# Altium project Industrial-Controller.PrjPcb (part 1 of 3)
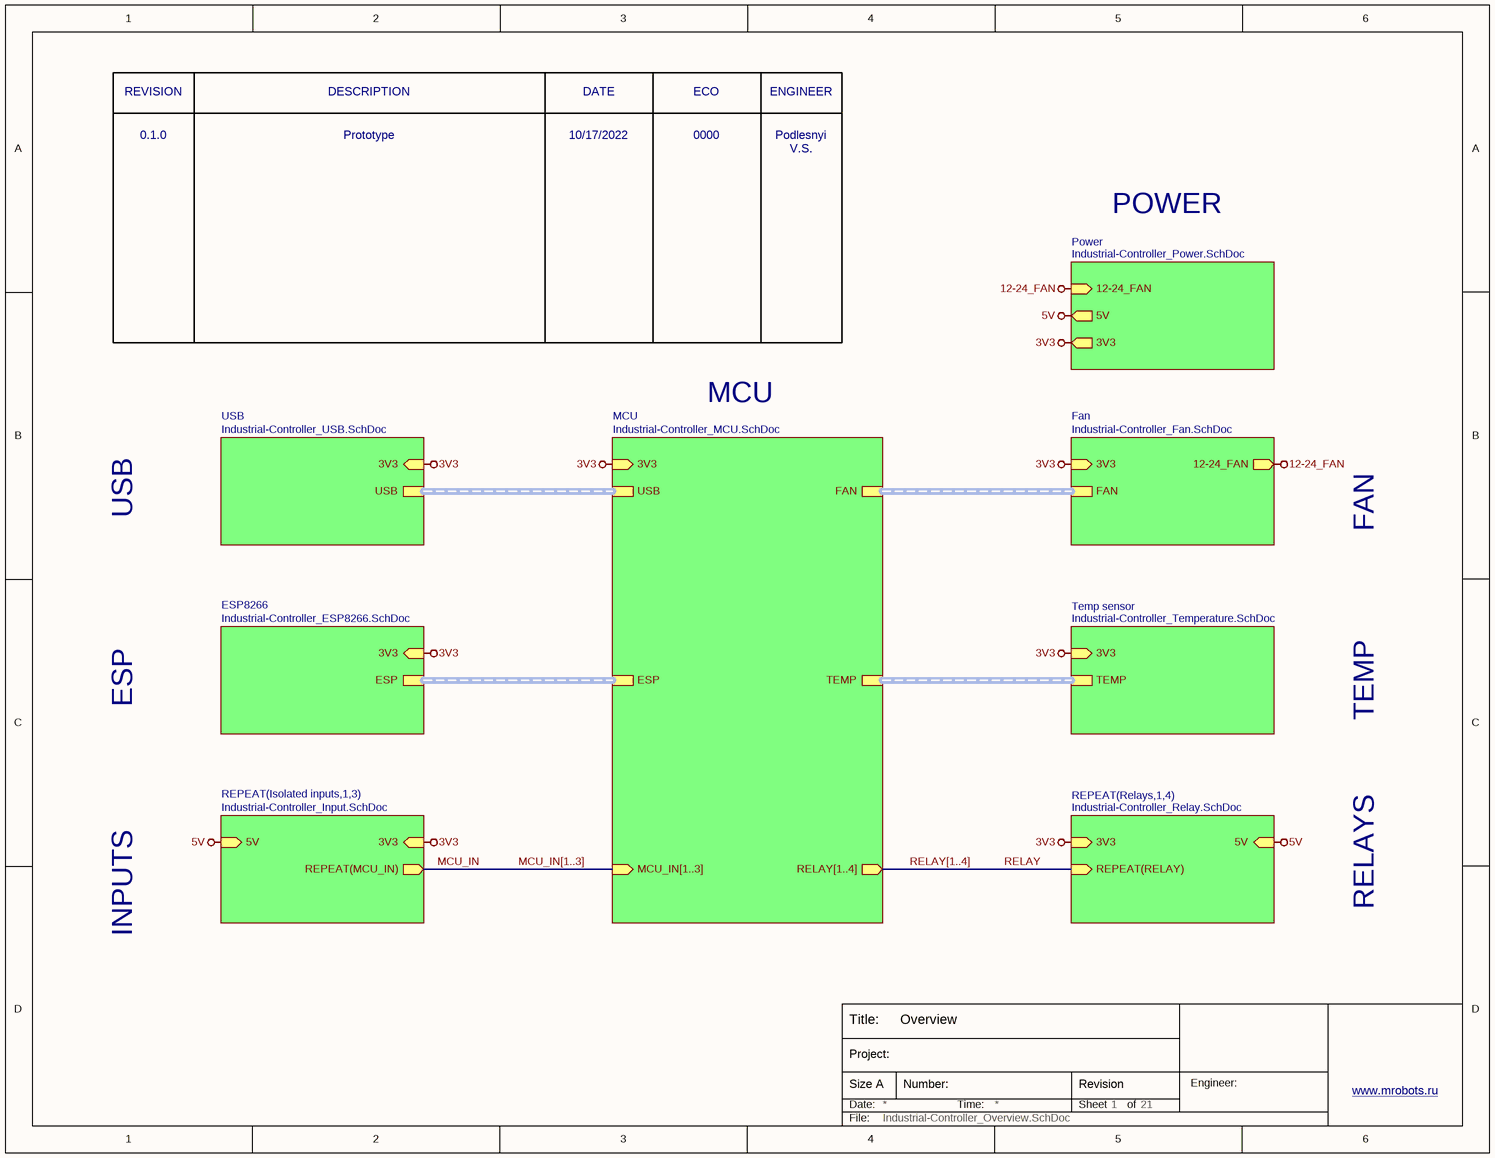
[diagram p0: Industrial-Controller_Overview.SchDoc]
GlobalAddress1: nab. reki Karpovki, d. 5/3E; GlobalAddress2: Saint-Petersburg, 197022; GlobalAddress3: Ph: +7 (911) 701-51-99; GlobalCompanyName: MRobot, LCC; GlobalDocumentNumberDrawingASM: 0000-0000; GlobalDocumentNumberDrawingPCB: 0000-0000; GlobalDocumentNumberPCB: 0000-0000; GlobalDocumentNumberSCH: 0000-0000; GlobalDocumentSubtitle: PLC; GlobalDocumentTitle: Industrial Controller; GlobalEngineer: Podlesnyi Vasilii; GlobalJiraKey: PLCMROBOT; GlobalProjectTitle: Industrial Controller; GlobalRevisionBOM: 0.1.0; GlobalRevisionPCB: 0.1.0; GlobalRevisionSCH: 0.1.0
9 sheets, 133 parts. Net scope: hierarchical (ports join the sheet entries above them; power ports are global).
Board file: Industrial-Controller.PcbDoc
Sheets:
  Industrial-Controller_Overview.SchDoc
    MCU = Industrial-Controller_MCU.SchDoc
    Temp sensor = Industrial-Controller_Temperature.SchDoc
    USB = Industrial-Controller_USB.SchDoc
    ESP8266 = Industrial-Controller_ESP8266.SchDoc
    Isolated inputs1 = Industrial-Controller_Input.SchDoc
    Isolated inputs2 = Industrial-Controller_Input.SchDoc
    Isolated inputs3 = Industrial-Controller_Input.SchDoc
    Relays1 = Industrial-Controller_Relay.SchDoc
    Relays2 = Industrial-Controller_Relay.SchDoc
    Relays3 = Industrial-Controller_Relay.SchDoc
    Relays4 = Industrial-Controller_Relay.SchDoc
    Fan = Industrial-Controller_Fan.SchDoc
    Power = Industrial-Controller_Power.SchDoc

## Sheet Industrial-Controller_Overview.SchDoc: Overview
size 279 x 215 mm; Date: not used; ApprovedBy: not used; CheckedBy: not used; Author: not used; CompanyName: MRobot, LCC; DrawnBy: not used; Engineer: Podlesnyi Vasilii; Organization: not used; Address1: nab. reki Karpovki, d. 5/3E; Address2: Saint-Petersburg, 197022; Address3: Ph: +7 (911) 701-51-99; Address4: not used; DocumentNumber: 0000-0000; Revision: 0.1.0; SheetNumber: 1; SheetTotal: 21; ProjectTitle: Industrial Controller; Time: not used; ImagePath: not used; Application_BuildNumber: not used

### Sub-sheets
ESP8266 = Industrial-Controller_ESP8266.SchDoc: 3V3 (in), ESP (harness ESP)
Fan = Industrial-Controller_Fan.SchDoc: FAN (harness FAN), 3V3 (in), 12-24_FAN (out)
MCU = Industrial-Controller_MCU.SchDoc: 3V3 (in), ESP (harness ESP), TEMP (harness TEMP), USB (harness USB), FAN (harness FAN), MCU_IN[1..3] (in), RELAY[1..4] (out)
Power = Industrial-Controller_Power.SchDoc: 3V3 (out), 12-24_FAN (in), 5V (out)
REPEAT(Isolated inputs,1,3) = Industrial-Controller_Input.SchDoc: 3V3 (in), 5V (in), REPEAT(MCU_IN) (out)
REPEAT(Relays,1,4) = Industrial-Controller_Relay.SchDoc: 3V3 (in), REPEAT(RELAY) (in), 5V (in)
Temp sensor = Industrial-Controller_Temperature.SchDoc: TEMP (harness TEMP), 3V3 (in)
USB = Industrial-Controller_USB.SchDoc: 3V3 (in), USB (harness USB)

### Nets
3V3: sheet MCU/3V3, sheet Temp sensor/3V3, sheet USB/3V3, sheet ESP8266/3V3, sheet REPEAT(Isolated inputs,1,3)/3V3, sheet REPEAT(Relays,1,4)/3V3, sheet Fan/3V3, sheet Power/3V3
5V: sheet REPEAT(Isolated inputs,1,3)/5V, sheet REPEAT(Relays,1,4)/5V, sheet Power/5V
12-24_FAN: sheet Fan/12-24_FAN, sheet Power/12-24_FAN
MCU_IN: sheet REPEAT(Isolated inputs,1,3)/REPEAT(MCU_IN)
RELAY: sheet REPEAT(Relays,1,4)/REPEAT(RELAY)

### Buses and harness runs
bus MCU_IN[1..3] = sheet MCU/MCU_IN[1..3]
bus RELAY[1..4] = sheet MCU/RELAY[1..4]
harness sheet ESP8266/ESP = sheet MCU/ESP
harness sheet Fan/FAN = sheet MCU/FAN
harness sheet MCU/TEMP = sheet Temp sensor/TEMP
harness sheet MCU/USB = sheet USB/USB

### Notes on the sheet
- REVISION
- DESCRIPTION
- DATE
- ECO
- ENGINEER
- POWER
- 0.1.0
- Prototype
- 10/17/2022
- 0000
- Podlesnyi V.S.
- MCU
- USB
- FAN
- ESP
- TEMP
- RELAYS
- INPUTS
- Title:
- Date:
- Size A
- Project:
- Number:
- Time:
- Sheet
- Revision
- of
- Engineer:
- www.mrobots.ru <http://mrobots.ru/>
- File:

## Sheet Industrial-Controller_MCU.SchDoc: MCU
size 279 x 215 mm; Date: not used; ApprovedBy: not used; CheckedBy: not used; Author: not used; CompanyName: MRobot, LCC; DrawnBy: not used; Engineer: Podlesnyi Vasilii; Organization: not used; Address1: nab. reki Karpovki, d. 5/3E; Address2: Saint-Petersburg, 197022; Address3: Ph: +7 (911) 701-51-99; Address4: not used; DocumentNumber: 0000-0000; Revision: 0.1.0; SheetNumber: 3; SheetTotal: 21; ProjectTitle: Industrial Controller; Time: not used; ImagePath: not used; Application_BuildNumber: not used
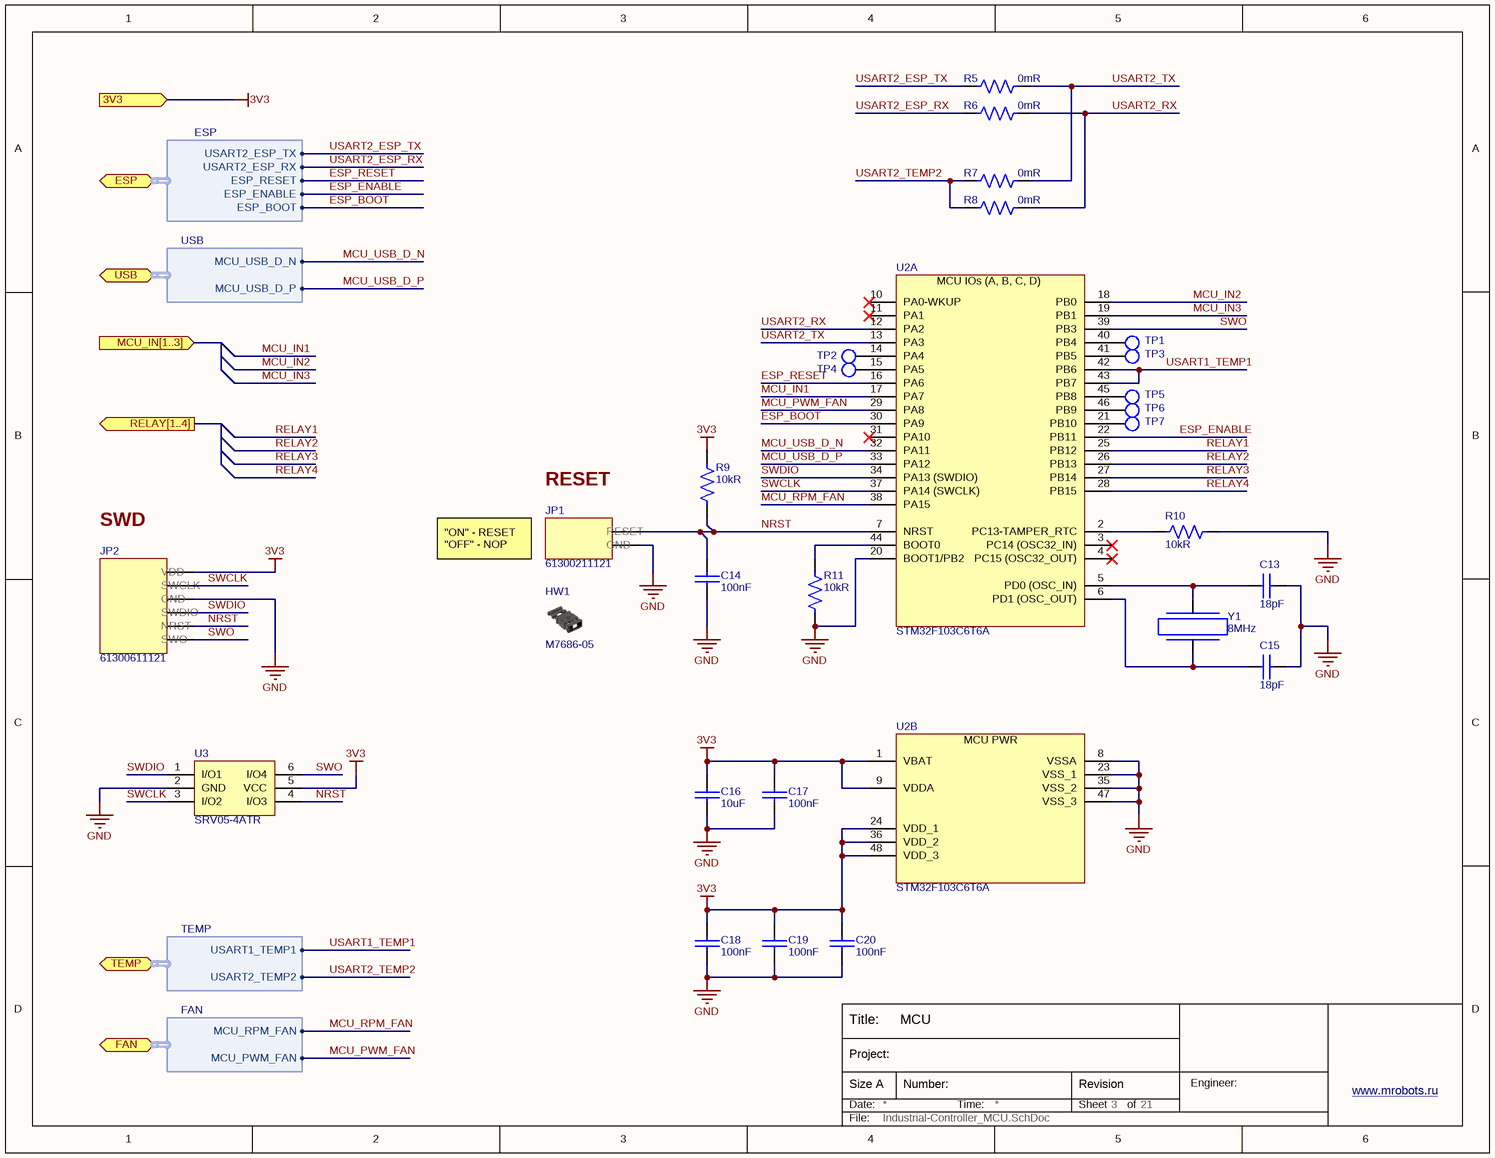
[diagram p1: Industrial-Controller_MCU.SchDoc]

### Parts
C13  18pF  [CAP_0603]
C14  100nF  [CAP_0603]
C15  18pF  [CAP_0603]
C16  10uF  [CAP_1210]
C17  100nF  [CAP_0603]
C18  100nF  [CAP_0603]
C19  100nF  [CAP_0603]
C20  100nF  [CAP_0603]
HW1  M7686-05  (mechanical)
JP1  61300211121  [PLS-2]
JP2  61300611121  [PLS-6]
R5  0mR  [RES_0603]
R6  0mR  [RES_0603]
R7  0mR  [RES_0603]
R8  0mR  [RES_0603]
R9  10kR  [RES_0603]
R10  10kR  [RES_0603]
R11  10kR  [RES_0603]
TP1  TEST_POINT_SMT  [TEST_POINT_SMT]  (value not drawn)  (no BOM)
TP2  TEST_POINT_SMT  [TEST_POINT_SMT]  (value not drawn)  (no BOM)
TP3  TEST_POINT_SMT  [TEST_POINT_SMT]  (value not drawn)  (no BOM)
TP4  TEST_POINT_SMT  [TEST_POINT_SMT]  (value not drawn)  (no BOM)
TP5  TEST_POINT_SMT  [TEST_POINT_SMT]  (value not drawn)  (no BOM)
TP6  TEST_POINT_SMT  [TEST_POINT_SMT]  (value not drawn)  (no BOM)
TP7  TEST_POINT_SMT  [TEST_POINT_SMT]  (value not drawn)  (no BOM)
U2  STM32F103C6T6A  [LQFP48]  (parts A,B of 2)
U3  SRV05-4ATR  [SOT-23-6]
Y1  8MHz  [HC-49/US]

### Ports
3V3 (in), ESP (bidir, harness ESP), FAN (bidir, harness FAN), MCU_IN[1..3] (in), RELAY[1..4] (out), TEMP (bidir, harness TEMP), USB (bidir, harness USB)

### Harnesses
ESP: USART2_ESP_TX, USART2_ESP_RX, ESP_RESET, ESP_ENABLE, ESP_BOOT
USB: MCU_USB_D_N, MCU_USB_D_P
FAN: MCU_RPM_FAN, MCU_PWM_FAN
TEMP: USART1_TEMP1, USART2_TEMP2

### Nets
3V3: C16.2 C17.1 C18.1 C19.1 C20.1 JP2.1 R9.1 U2.1(VBAT) U2.9(VDDA) U2.24(VDD_1) U2.36(VDD_2) U2.48(VDD_3) U3.5(VCC) ; port 3V3
GND: C13.2 C14.2 C15.2 C16.1 C17.2 C18.2 C19.2 C20.2 JP1.2 JP2.3 R10.1 R11.1 U2.8(VSSA) U2.20(BOOT1/PB2) U2.23(VSS_1) U2.35(VSS_2) U2.47(VSS_3) U3.2(GND)
ESP_BOOT: U2.30(PA9) ; port ESP.ESP_BOOT
ESP_ENABLE: U2.22(PB11) ; port ESP.ESP_ENABLE
ESP_RESET: U2.16(PA6) ; port ESP.ESP_RESET
MCU_IN1: U2.17(PA7)
MCU_IN2: U2.18(PB0)
MCU_IN3: U2.19(PB1)
MCU_PWM_FAN: U2.29(PA8) ; port FAN.MCU_PWM_FAN
MCU_RPM_FAN: U2.38(PA15) ; port FAN.MCU_RPM_FAN
MCU_USB_D_N: U2.32(PA11) ; port USB.MCU_USB_D_N
MCU_USB_D_P: U2.33(PA12) ; port USB.MCU_USB_D_P
NRST: C14.1 JP1.1 JP2.5 R9.2 U2.7(NRST) U3.4(I/O3)
RELAY1: U2.25(PB12)
RELAY2: U2.26(PB13)
RELAY3: U2.27(PB14)
RELAY4: U2.28(PB15)
SWCLK: JP2.2 U2.37(PA14_(SWCLK)) U3.3(I/O2)
SWDIO: JP2.4 U2.34(PA13_(SWDIO)) U3.1(I/O1)
SWO: JP2.6 U2.39(PB3) U3.6(I/O4)
USART1_TEMP1: U2.42(PB6) U2.43(PB7) ; port TEMP.USART1_TEMP1
USART2_ESP_RX: R6.1 ; port ESP.USART2_ESP_RX
USART2_ESP_TX: R5.1 ; port ESP.USART2_ESP_TX
USART2_RX: R6.2 R8.2 U2.12(PA2)
USART2_TEMP2: R7.1 R8.1 ; port TEMP.USART2_TEMP2
USART2_TX: R5.2 R7.2 U2.13(PA3)
NetC13_1: C13.1 U2.5(PD0_(OSC_IN)) Y1.2
NetC15_1: C15.1 U2.6(PD1_(OSC_OUT)) Y1.1
NetR10_2: R10.2 U2.2(PC13-TAMPER_RTC)
NetR11_2: R11.2 U2.44(BOOT0)
NetTP1_1: TP1.1 U2.40(PB4)
NetTP2_1: TP2.1 U2.14(PA4)
NetTP3_1: TP3.1 U2.41(PB5)
NetTP4_1: TP4.1 U2.15(PA5)
NetTP5_1: TP5.1 U2.45(PB8)
NetTP6_1: TP6.1 U2.46(PB9)
NetTP7_1: TP7.1 U2.21(PB10)

Not connected (* = marked no-connect by the designer): U2 3(PC14_(OSC32_IN))* 4(PC15_(OSC32_OUT))* 10(PA0-WKUP)* 11(PA1)* 31(PA10)*

### Notes on the sheet
- (near JP1) RESET
- SWD
- (near HW1) "ON" - RESET
  "OFF" - NOP
- Title:
- Date:
- Size A
- Project:
- Number:
- Time:
- Sheet
- Revision
- of
- Engineer:
- www.mrobots.ru <http://mrobots.ru/>
- File:
- (in symbol STM32F103C6T6A, part A) MCU IOs (A, B, C, D)
- (in symbol STM32F103C6T6A, part B) MCU PWR

### Library data of the parts
C13 C15 = C0603C180J5GACAUTO: CAP CER 18PF 50V C0G/NP0 0603; Manufacturer: KEMET; Dielectric Material: Ceramic; Tolerance: 5%; Dielectric: C0G; Supplier 1: Arrow Electronics; Manufacturer Part Number: C0603C180J5GACAUTO; RoHS: Yes; Category: Ceramic Capacitors; Stock 1: 13801; Pricing 1: 1=0.10780, 10=0.04490, 25=0.04440, 100=0.03270, 250=0.03140, 500=0.02510, 1000=0.01950, 3000=0.01910, 6000=0.01510 (USD); Case/Package: 0603; Min Operating Temperature: -55°C; Max Operating Temperature: 125°C; Packaging: Tape and Reel; Capacitance: 18pF; Voltage Rating (DC): 50V; Length: 1.6mm; Depth: 0.8mm; Lead Free: Lead Free; RoHS Compliant: Yes; ComponentLink1URL: http://www.farnell.com/datasheets/2747367.pdf?src-supplier=Farnell; ComponentLink1Description: http://www.farnell.com/datasheets/2747367.pdf?src-supplier=Farnell; ComponentLink2URL: https://api.kemet.com/component-edge/download/datasheet/C0603C180J5GACAUTO.pdf?src-supplier=Digi-Key; ComponentLink2Description: https://api.kemet.com/component-edge/download/datasheet/C0603C180J5GACAUTO.pdf?src-supplier=Digi-Key; ComponentLink3URL: http://www.farnell.com/datasheets/2747367.pdf?src-supplier=Newark; ComponentLink3Description: http://www.farnell.com/datasheets/2747367.pdf?src-supplier=Newark; ComponentLink4URL: http://www.farnell.com/datasheets/2747367.pdf?src-supplier=Element14; ComponentLink4Description: http://www.farnell.com/datasheets/2747367.pdf?src-supplier=Element14; Supplier Part Number 1: C0603C180J5GACAUTO; Manufacturer 1: KEMET; Manufacturer Part Number 1: C0603C180J5GACAUTO
C14 C17-C20 = CL10B104KB8NNNL: CAP CER 0.1UF 50V X7R 0603; Manufacturer 1: Samsung; Tolerance: 10%; Supplier 1: Digi-Key; Manufacturer Part Number 1: CL10B104KB8NNNL; RoHS: Yes; Category: Ceramic Capacitors; Stock 1: 2348404; Pricing 1: 15000=0,00532, 30000=0,00506 (USD); Mount: Surface Mount; Case/Package: 0603; Min Operating Temperature: -55°C; Max Operating Temperature: 125°C; Capacitance: 100nF; Packaging: Tape and Reel; Package Quantity: 15000; Voltage Rating: 50V; Dielectric: X7R; Voltage Rating (DC): 50V; Series: CL; Construction: Flat; Length: 1.6mm; Width: 0.031inch; Height: 0.8mm; Thickness: 0.035inch; Depth: 0.8mm; Radiation Hardening: No; RoHS Compliant: Yes; ComponentLink1URL: https://datasheet.ciiva.com/26838/getdatasheetpartid-357523-26838415.pdf?src-supplier=Verical; ComponentLink1Description: https://datasheet.ciiva.com/26838/getdatasheetpartid-357523-26838415.pdf?src-supplier=Verical; ComponentLink2URL: https://datasheet.ciiva.com/25741/cl10b104kb8nnnl-25741341.pdf?src-supplier=Digi-Key; ComponentLink2Description: https://datasheet.ciiva.com/25741/cl10b104kb8nnnl-25741341.pdf?src-supplier=Digi-Key; Supplier Part Number 1: 1276-CL10B104KB8NNNLTR-ND
C16 = CL32B106KBJNNWE: CAP CER 10UF 50V X7R 1210; Manufacturer 1: Samsung; Tolerance: 10%; Supplier 1: Digi-Key; Manufacturer Part Number 1: CL32B106KBJNNWE; RoHS: Yes; Category: Ceramic Capacitors; Stock 1: 395336; Pricing 1: 1=0,64000, 10=0,45500, 50=0,34380, 100=0,29940, 500=0,22176 (USD); Mount: Surface Mount; Case/Package: 1210; Case Code (Imperial): 1210; Case Code (Metric): 3225; Min Operating Temperature: -55°C; Max Operating Temperature: 125°C; Dielectric: X7R; Capacitance: 10uF; Voltage Rating: 50V; Package Quantity: 1; Packaging: Tape and Reel; Length: 0.126inch; Width: 0.098inch; Thickness: 0.106inch; Lead Free: Lead Free; ComponentLink1URL: https://datasheet.ciiva.com/25721/cl32b106kbjnnwe-25721651.pdf?src-supplier=Digi-Key; ComponentLink1Description: https://datasheet.ciiva.com/25721/cl32b106kbjnnwe-25721651.pdf?src-supplier=Digi-Key; Supplier Part Number 1: 1276-3388-1-ND
HW1 = M7686-05: CLOSED TOP JUMPER SOCKET; Manufacturer 1: Harwin; Plating: Gold; Number of Contacts: 2; Contact Resistance: 25mR; Current Rating: 3A; Mating Cycles: 300; Voltage Rating (AC): 250V; Gender: Receptacle; Insulation Resistance: 1GR; Pitch: 2.54mm; Body Length: 10mm; Supplier 1: Digi-Key; Manufacturer Part Number 1: M7686-05; RoHS: Yes; Category: Terminal Blocks; Stock 1: 26597; Pricing 1: 1=0,40000, 10=0,34400, 25=0,30280, 50=0,27820, 100=0,26720, 250=0,23996, 500=0,22906, 1000=0,19089, 2500=0,17453 (USD); Housing Color: Black; Contact Material: Bronze; Contact Plating: Gold; Color: Black; Material: Polyester; Weight: 0.0625lb; Housing Material: Polyester; Min Operating Temperature: -40°C; Max Operating Temperature: 85°C; Number of Rows: 1; Voltage Rating (DC): 250V; Contact Gender: Female; Package Quantity: 2500; Voltage Rating: 250V; Max Current Rating: 3A; Number of Positions: 2; Packaging: Bulk; Max Voltage Rating (AC): 250V; Orientation: Straight; Series: M76; Length: 10mm; Width: 5mm; Height: 0.394inch; Lead Pitch: 2.54mm; Depth: 2.4mm; Radiation Hardening: No; REACH SVHC: No SVHC; Flammability Rating: UL94 V-0; RoHS Compliant: Yes; ComponentLink1URL: https://datasheet.ciiva.com/11754/0900766b81034e4c-11754957.pdf?src-supplier=RSComponents; ComponentLink1Description: https://datasheet.ciiva.com/11754/0900766b81034e4c-11754957.pdf?src-supplier=RSComponents; ComponentLink2URL: https://datasheet.ciiva.com/6781/m7684-m7687-6781583.pdf?src-supplier=Digi-Key; ComponentLink2Description: https://datasheet.ciiva.com/6781/m7684-m7687-6781583.pdf?src-supplier=Digi-Key; Supplier Part Number 1: 952-2023-ND
JP1 = 61300211121: CONN HEADER VERT 2POS 2.54MM; Manufacturer 1: Wurth Electronics; Current Rating: 3A; Voltage Rating: 250V; Number of Positions: 2; Gender: Male; Connector Type: Male Pin; Pitch: 0.1inch; Contact_1: RESET; Contact_2: GND; Supplier 1: Digi-Key; RoHS: Yes; Category: Headers and Wire Housings; Pricing 1: 1=0.13000, 10=0.11000, 25=0.09120, 50=0.07700, 100=0.06900, 1000=0.06300 (USD); Mount: Through Hole; Contact Plating: Gold; Housing Material: PBT; Contact Material: Copper Alloy,Copper; Color: Black; Min Operating Temperature: -40°C; Max Operating Temperature: 125°C; Number of Rows: 1; Contact Gender: Male; Packaging: Bulk; Termination: Through Hole; Number of Contacts: 2; Series: WR-PHD; Contact Type: Male Pin; Contact Mating Length: 0.236inch; REACH SVHC: Unknown; Lead Free: Lead Free; RoHS Compliant: Yes; ComponentLink1URL: https://datasheet.ciiva.com/13619/6130xx11121-48870-13619345.pdf?src-supplier=Mouser; ComponentLink1Description: https://datasheet.ciiva.com/13619/6130xx11121-48870-13619345.pdf?src-supplier=Mouser; Supplier Part Number 1: 732-5315-ND; Manufacturer Part Number 1: 61300211121
JP2 = 61300611121: CONN HEADER VERT 6POS 2.54MM; Manufacturer 1: Wurth Electronics; Current Rating: 3A; Voltage Rating: 250V; Number of Positions: 6; Gender: Male; Connector Type: Male Pin; Pitch: 0.1inch; Contact_1: VDD; Contact_2: SWCLK; Contact_3: GND; Contact_4: SWDIO; Contact_5: NRST; Contact_6: SWO; Supplier 1: Digi-Key; RoHS: Yes; Category: Headers and Wire Housings; Stock 1: 8041; Pricing 1: 1=0.34000, 10=0.28900, 25=0.24000, 50=0.20100, 100=0.18200, 1000=0.16600 (USD); Mount: Through Hole; Contact Plating: Gold; Contact Material: Copper Alloy,Copper; Housing Material: PBT; Color: Black; Min Operating Temperature: -40°C; Max Operating Temperature: 125°C; Number of Rows: 1; Contact Gender: Male; Packaging: Bulk; Termination: Through Hole; Number of Contacts: 6; Series: WR-PHD; Contact Type: Male Pin; Contact Mating Length: 0.236inch; REACH SVHC: Unknown; Lead Free: Lead Free; RoHS Compliant: Yes; ComponentLink1URL: http://www.mouser.com/ds/2/445/6130xx11121-538006.pdf?src-supplier=Mouser; ComponentLink1Description: http://www.mouser.com/ds/2/445/6130xx11121-538006.pdf?src-supplier=Mouser; ComponentLink2URL: http://www.farnell.com/cad/1737268.pdf?src-supplier=Element14; ComponentLink2Description: http://www.farnell.com/cad/1737268.pdf?src-supplier=Element14; ComponentLink3URL: https://katalog.we-online.de/em/datasheet/6130xx11121.pdf?src-supplier=Digi-Key; ComponentLink3Description: https://katalog.we-online.de/em/datasheet/6130xx11121.pdf?src-supplier=Digi-Key; Supplier Part Number 1: 732-5319-ND; Manufacturer Part Number 1: 61300611121
R5-R8 = RC0603FR-070RL: RES 0 OHM JUMPER 1/10W 0603; Manufacturer 1: Yageo; Power Rating: 100mW; Tolerance: 1%; Voltage Rating (DC): 50V; Temperature Coefficient: 200ppm/°C; Current Rating: 1A; Working Voltage: 75V; Supplier 1: Arrow Electronics; RoHS: Yes; Category: Chip SMD Resistors; Stock 1: 2434418; Pricing 1: 5000=0,00220 (USD); Case/Package: 0603; Number of Pins: 2; Contact Plating: Tin,Matte; Case Code (Metric): 1608; Case Code (Imperial): 0603; Min Operating Temperature: -55°C; Max Operating Temperature: 155°C; Resistance: 0mR; Packaging: Tape and Reel; Resistor Type: Thick Film; Package Quantity: 5000; Voltage Rating: 50V; Number of Terminations: 2; Termination: SMD/SMT; Max Power Dissipation: 100mW; Features: Moisture Resistant; Series: RC; Construction: Rectangular; Resistance Tolerance: 1%; Technology: THICK FILM; Length: 1.6mm; Width: 0.031inch; Height: 0.45mm; Depth: 0.8mm; Radiation Hardening: No; REACH SVHC: No SVHC; Lead Free: Lead Free; RoHS Compliant: Yes; Military Standard: Not; ComponentLink1URL: https://datasheet.ciiva.com/11808/0900766b80f96399-11808172.pdf?src-supplier=RSComponents; ComponentLink1Description: https://datasheet.ciiva.com/11808/0900766b80f96399-11808172.pdf?src-supplier=RSComponents; ComponentLink2URL: https://datasheet.ciiva.com/5684/443971-5684699.pdf?src-supplier=Farnell; ComponentLink2Description: https://datasheet.ciiva.com/5684/443971-5684699.pdf?src-supplier=Farnell; ComponentLink3URL: https://datasheet.ciiva.com/7983/443971-7983627.pdf?src-supplier=Element14; ComponentLink3Description: https://datasheet.ciiva.com/7983/443971-7983627.pdf?src-supplier=Element14; ComponentLink4URL: https://datasheet.ciiva.com/22643/1868787-22643388.pdf?src-supplier=Element14; ComponentLink4Description: https://datasheet.ciiva.com/22643/1868787-22643388.pdf?src-supplier=Element14; ComponentLink5URL: https://datasheet.ciiva.com/46382/443971-46382072.pdf?src-supplier=Element14; ComponentLink5Description: https://datasheet.ciiva.com/46382/443971-46382072.pdf?src-supplier=Element14; ComponentLink6URL: https://datasheet.ciiva.com/29721/pyu-r-int-thick-7-29721178.pdf?src-supplier=Digi-Key; ComponentLink6Description: https://datasheet.ciiva.com/29721/pyu-r-int-thick-7-29721178.pdf?src-supplier=Digi-Key; ComponentLink7URL: https://datasheet.ciiva.com/29721/pyu-rc0603-51-rohs-l-4-29721179.pdf?src-supplier=Digi-Key; ComponentLink7Description: https://datasheet.ciiva.com/29721/pyu-rc0603-51-rohs-l-4-29721179.pdf?src-supplier=Digi-Key; ComponentLink8URL: https://datasheet.ciiva.com/5558/rc0603-272842-5558341.pdf?src-supplier=Mouser; ComponentLink8Description: https://datasheet.ciiva.com/5558/rc0603-272842-5558341.pdf?src-supplier=Mouser; Supplier Part Number 1: RC0603FR-070RL; Manufacturer Part Number 1: RC0603FR-070RL
R9-R11 = RC0603FR-0710KL: RES 10K OHM 1% 1/10W 0603; Manufacturer 1: Yageo; Voltage Rating (DC): 50V; Temperature Coefficient: 100ppm/°C; Power Rating: 100mW; Voltage Rating: 75V; Supplier 1: Arrow Electronics; RoHS: Yes; Category: Chip SMD Resistors; Stock 1: 4950000; Pricing 1: 5000=0,00240 (USD); Case/Package: 0603; Number of Pins: 2; Case Code (Imperial): 0603; Case Code (Metric): 1608; Weight: 7.1E-05oz; Size Code: 0603; Min Operating Temperature: -55°C; Max Operating Temperature: 155°C; Packaging: Tape and Reel; Resistance: 10kR; Tolerance: 1%; Resistor Type: Thick Film; Termination: SMD/SMT; Features: Moisture Resistant; Series: RC; Max Power Dissipation: 100mW; Number of Terminations: 2; Resistance Tolerance: 1%; Construction: Rectangular; Length: 1.6mm; Width: 0.8mm; Height: 0.45mm; Depth: 0.8mm; Lead Pitch: 0.3mm; REACH SVHC: Unknown; Lead Free: Lead Free; Military Standard: Not; RoHS Compliant: Yes; ComponentLink1URL: https://datasheet.ciiva.com/7660/38590-7660789.pdf?src-supplier=Element14; ComponentLink1Description: https://datasheet.ciiva.com/7660/38590-7660789.pdf?src-supplier=Element14; ComponentLink2URL: https://datasheet.ciiva.com/7983/443971-7983596.pdf?src-supplier=Element14; ComponentLink2Description: https://datasheet.ciiva.com/7983/443971-7983596.pdf?src-supplier=Element14; ComponentLink3URL: https://datasheet.ciiva.com/22747/443971-22747519.pdf?src-supplier=Element14; ComponentLink3Description: https://datasheet.ciiva.com/22747/443971-22747519.pdf?src-supplier=Element14; ComponentLink4URL: https://datasheet.ciiva.com/46440/1868787-46440891.pdf?src-supplier=Element14; ComponentLink4Description: https://datasheet.ciiva.com/46440/1868787-46440891.pdf?src-supplier=Element14; ComponentLink5URL: https://datasheet.ciiva.com/7746/1738695-7746239.pdf?src-supplier=Element14; ComponentLink5Description: https://datasheet.ciiva.com/7746/1738695-7746239.pdf?src-supplier=Element14; Supplier Part Number 1: RC0603FR-0710KL; Manufacturer Part Number 1: RC0603FR-0710KL
TP1-TP7 = TEST_POINT_SMT: STM TEST POINT
U2 = STM32F103C6T6A: IC MCU 32BIT 32KB FLASH 48LQFP; Manufacturer 1: STMicroelectronics; Number of Timers/Counters: 3; Max Supply Voltage: 3.6V; Frequency: 72MHz; Interface: I2C,SPI,USART; RAM Size: 10KB; Max Power Dissipation: 363mW; Number of I/Os: 37; Min Supply Voltage: 2V; Oscillator Type: Internal; Data Bus Width: 32b; Watchdog Timer: Yes; Peripherals: POR,PWM,WDT,DMA,Temp Sensor,I2C; Core Architecture: ARM; Number of ADC Channels: 10; Number of SPI Channels: 1; Supplier 1: Newark; RoHS: Yes; Category: Microcontrollers; Pricing 1: 1=6,56000, 10=5,90000, 1500=5,90000 (USD); Case/Package: LQFP; Number of Pins: 48; Weight: 0.006409oz; Min Operating Temperature: -40°C; Max Operating Temperature: 85°C; Package Quantity: 1500; Packaging: Tray; Max Frequency: 72MHz; Number of Programmable I/O: 37; Memory Type: FLASH; Memory Size: 32KB; Series: STM32F103C6; Number of I2C Channels: 1; Address Bus Width: 32b; Length: 7mm; Width: 7mm; Height: 1.4mm; Radiation Hardening: No; Lead Free: Lead Free; REACH SVHC: No SVHC; RoHS Compliant: Yes; ComponentLink1URL: https://datasheet.ciiva.com/15122/getdatasheetpartid-69879-15122075.pdf?src-supplier=Verical; ComponentLink1Description: https://datasheet.ciiva.com/15122/getdatasheetpartid-69879-15122075.pdf?src-supplier=Verical; ComponentLink2URL: https://datasheet.ciiva.com/14100/pustm-arm-microcont-stm32f103-en-14100507.pdf?src-supplier=Distrelec; ComponentLink2Description: https://datasheet.ciiva.com/14100/pustm-arm-microcont-stm32f103-en-14100507.pdf?src-supplier=Distrelec; Supplier Part Number 1: 57P1219; Manufacturer Part Number 1: STM32F103C6T6A
U3 = SRV05-4ATR: TVS DIODE 5VWM 17.5VC SOT23-6; Manufacturer 1: Sangdest Microelectronics; Supplier 1: Digi-Key; Manufacturer Part Number 1: SRV05-4ATR; RoHS: No; Category: TVS Diodes; Stock 1: 31500; Pricing 1: 1=0,45000, 10=0,36700, 100=0,24990, 500=0,18744, 1000=0,14058 (USD); Supplier Part Number 1: 1655-1653-1-ND
Y1 = ATS080B-E: CRYSTAL 8.0000MHZ 18PF TH; Manufacturer 1: CTS; Frequency Tolerance: 30ppm; ESR (Equivalent Series Resistance): 60R; Frequency Stability: 50ppm; Supplier 1: Avnet; RoHS: Yes; Category: Crystals; Stock 1: 4510; Pricing 1: 1000=0.18120, 1200=0.17880, 2200=0.17040, 5000=0.13800, 10000=0.12150, 50000=0.10956, 100000=0.10707 (USD); Mount: Through Hole; Number of Pins: 2; Contact Plating: Copper,Tin,Silver; Min Operating Temperature: -40°C; Max Operating Temperature: 85°C; Package Quantity: 100; Frequency: 8MHz; Load Capacitance: 18pF; Packaging: Bulk; Tolerance: 30ppm; Termination: Radial; Series: ATS; Length: 0.427inch; Width: 0.177inch; Height: 0.145inch; RoHS Compliant: Yes; ComponentLink1URL: https://datasheet.ciiva.com/859/008-0309-0-859649.pdf?src-supplier=Digi-Key; ComponentLink1Description: https://datasheet.ciiva.com/859/008-0309-0-859649.pdf?src-supplier=Digi-Key; ComponentLink2URL: https://datasheet.ciiva.com/3176/008-0309-0-3176342.pdf?src-supplier=Avnet; ComponentLink2Description: https://datasheet.ciiva.com/3176/008-0309-0-3176342.pdf?src-supplier=Avnet; ComponentLink3URL: https://datasheet.ciiva.com/4945/008-0309-0-32667-4945355.pdf?src-supplier=Mouser; ComponentLink3Description: https://datasheet.ciiva.com/4945/008-0309-0-32667-4945355.pdf?src-supplier=Mouser; Supplier Part Number 1: ATS080B-E; Manufacturer Part Number 1: ATS080B-E

## Sheet Industrial-Controller_Temperature.SchDoc: Temp sensor
size 279 x 215 mm; Date: not used; ApprovedBy: not used; CheckedBy: not used; Author: not used; CompanyName: MRobot, LCC; DrawnBy: not used; Engineer: Podlesnyi Vasilii; Organization: not used; Address1: nab. reki Karpovki, d. 5/3E; Address2: Saint-Petersburg, 197022; Address3: Ph: +7 (911) 701-51-99; Address4: not used; DocumentNumber: 0000-0000; Revision: 0.1.0; SheetNumber: 7; SheetTotal: 21; ProjectTitle: Industrial Controller; Time: not used; ImagePath: not used; Application_BuildNumber: not used
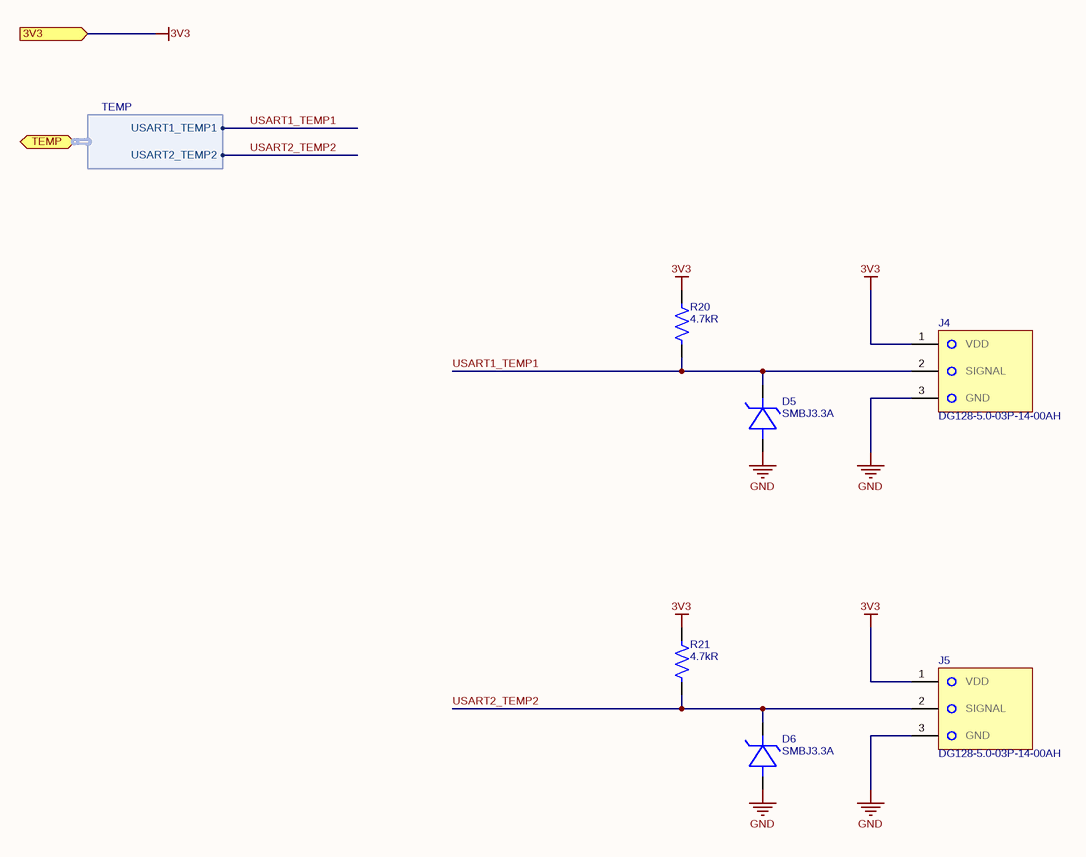
[diagram p2: Industrial-Controller_Temperature.SchDoc]

### Parts
D5  SMBJ3.3A  [SMB]
D6  SMBJ3.3A  [SMB]
J4  DG128-5.0-03P-14-00AH  [DG128-5.0-03P-14]
J5  DG128-5.0-03P-14-00AH  [DG128-5.0-03P-14]
R20  4.7kR  [RES_0603]
R21  4.7kR  [RES_0603]

### Ports
3V3 (in), TEMP (bidir, harness TEMP)

### Harnesses
TEMP: USART1_TEMP1, USART2_TEMP2

### Nets
3V3: J4.1 J5.1 R20.1 R21.1 ; port 3V3
GND: D5.2(A) D6.2(A) J4.3 J5.3
USART1_TEMP1: D5.1(C) J4.2 R20.2 ; port TEMP.USART1_TEMP1
USART2_TEMP2: D6.1(C) J5.2 R21.2 ; port TEMP.USART2_TEMP2

### Notes on the sheet
- Title:
- Date:
- Size A
- Project:
- Number:
- Time:
- Sheet
- Revision
- of
- Engineer:
- www.mrobots.ru <http://mrobots.ru/>
- File:

### Library data of the parts
D5 D6 = SMBJ3.3A: TVS DIODE 3.3VWM 4.1VC SMB; Manufacturer 1: JGD Semiconductors Co.,Ltd; Manufacturer Part Number 1: SMBJ3.3A
J4 J5 = DG128-5.0-03P-14: TERM BLK 3P TOP ENTRY 5MM SMD; Manufacturer 1: Degson; Number of Contacts: 3; Stripping Length: 7mm; Contact_1: VDD; Contact_2: SIGNAL; Contact_3: GND; Category: Uncategorized; Color: Green; Contact Material: Brass,Tin; Height: 17.6mm; Length: 10.2mm; Mount: Screw; Pitch: 5mm; Weight: 4g; Width: 15mm; Manufacturer Part Number 1: DG128-5.0-03P-14-00AH
R20 R21 = RC0603FR-074K7L: RES 4.7K OHM 1% 1/10W 0603; Manufacturer 1: Yageo; Power Rating: 100mW; Voltage Rating (DC): 50V; Temperature Coefficient: 100ppm/°C; Supplier 1: Arrow Electronics; RoHS: Yes; Category: Chip SMD Resistors; Stock 1: 14200000; Pricing 1: 5000=0,00180, 50000=0,00170, 125000=0,00140 (USD); Case/Package: 0603; Number of Pins: 2; Case Code (Imperial): 0603; Case Code (Metric): 1608; Size Code: 0603; Min Operating Temperature: -55°C; Max Operating Temperature: 155°C; Tolerance: 1%; Packaging: Tape and Reel; Resistance: 4.7kR; Resistor Type: Thick Film; Voltage Rating: 50V; Termination: SMD/SMT; Features: Moisture Resistant; Series: RC; Max Power Dissipation: 100mW; Number of Terminations: 2; Construction: Rectangular; Resistance Tolerance: 1%; Length: 1.6mm; Width: 0.8mm; Height: 0.45mm; Depth: 0.8mm; Lead Pitch: 0.3mm; REACH SVHC: No SVHC; Lead Free: Lead Free; RoHS Compliant: Yes; Military Standard: Not; ComponentLink1URL: https://datasheet.ciiva.com/15189/getdatasheetpartid-422754-15189760.pdf?src-supplier=Verical; ComponentLink1Description: https://datasheet.ciiva.com/15189/getdatasheetpartid-422754-15189760.pdf?src-supplier=Verical; ComponentLink2URL: https://datasheet.ciiva.com/7660/38590-7660794.pdf?src-supplier=Element14; ComponentLink2Description: https://datasheet.ciiva.com/7660/38590-7660794.pdf?src-supplier=Element14; ComponentLink3URL: https://datasheet.ciiva.com/22747/443971-22747528.pdf?src-supplier=Element14; ComponentLink3Description: https://datasheet.ciiva.com/22747/443971-22747528.pdf?src-supplier=Element14; ComponentLink4URL: https://datasheet.ciiva.com/46440/1868787-46440909.pdf?src-supplier=Element14; ComponentLink4Description: https://datasheet.ciiva.com/46440/1868787-46440909.pdf?src-supplier=Element14; ComponentLink5URL: https://datasheet.ciiva.com/7746/1868787-7746365.pdf?src-supplier=Element14; ComponentLink5Description: https://datasheet.ciiva.com/7746/1868787-7746365.pdf?src-supplier=Element14; ComponentLink6URL: https://datasheet.ciiva.com/7746/1738695-7746366.pdf?src-supplier=Element14; ComponentLink6Description: https://datasheet.ciiva.com/7746/1738695-7746366.pdf?src-supplier=Element14; Supplier Part Number 1: RC0603FR-074K7L; Manufacturer Part Number 1: RC0603FR-074K7L

## Sheet Industrial-Controller_USB.SchDoc: USB
size 279 x 215 mm; Date: not used; ApprovedBy: not used; CheckedBy: not used; Author: not used; CompanyName: MRobot, LCC; DrawnBy: not used; Engineer: Podlesnyi Vasilii; Organization: not used; Address1: nab. reki Karpovki, d. 5/3E; Address2: Saint-Petersburg, 197022; Address3: Ph: +7 (911) 701-51-99; Address4: not used; DocumentNumber: 0000-0000; Revision: 0.1.0; SheetNumber: 4; SheetTotal: 21; ProjectTitle: Industrial Controller; Time: not used; ImagePath: not used; Application_BuildNumber: not used
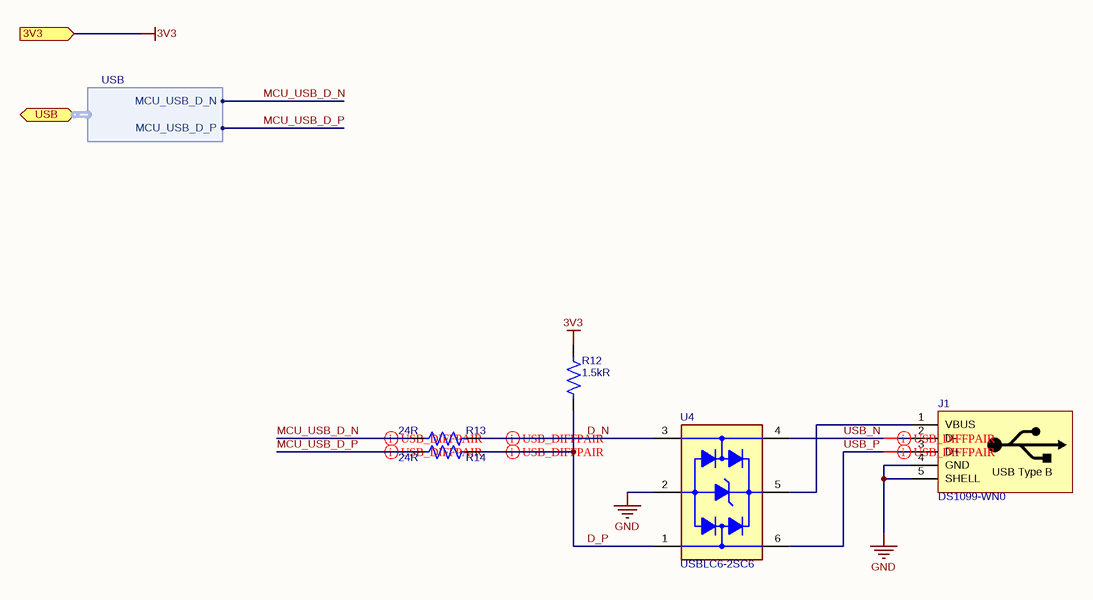
[diagram p3: Industrial-Controller_USB.SchDoc]

### Parts
J1  DS1099-WN0  [DS1099-WN0]
R12  1.5kR  [RES_0603]
R13  24R  [RES_0603]
R14  24R  [RES_0603]
U4  USBLC6-2SC6  [SOT-23-6]

### Ports
3V3 (in), USB (bidir, harness USB)

### Harnesses
USB: MCU_USB_D_N, MCU_USB_D_P

### Nets
3V3: R12.1 ; port 3V3
GND: J1.4(GND) J1.5(SHELL) U4.2(GND)
D_N: R13.2 U4.3(I/O_2)
D_P: R12.2 R14.2 U4.1(I/O_1)
MCU_USB_D_N: R13.1 ; port USB.MCU_USB_D_N
MCU_USB_D_P: R14.1 ; port USB.MCU_USB_D_P
USB_N: J1.2(D-) U4.4(I/O_3)
USB_P: J1.3(D+) U4.6(I/O_4)
NetJ1_1: J1.1(VBUS) U4.5(VBUS)

### Layout directives
differential pair; differential pair class USB_DIFFPAIR: D_N, D_P, MCU_USB_D_N, MCU_USB_D_P, USB_N, USB_P

### Notes on the sheet
- Title:
- Date:
- Size A
- Project:
- Number:
- Time:
- Sheet
- Revision
- of
- Engineer:
- www.mrobots.ru <http://mrobots.ru/>
- File:
- (in symbol DS1099-WN0) USB Type B

### Library data of the parts
J1 = DS1099-WN0: CONN TYPE B SKT HORIZONTAL TH; Manufacturer 1: Ningbo Connfly Electric; Manufacturer Part Number 1: DS1099-WN0
R12 = RC0603FR-071K5L: RES 1.5K OHM 1% 1/10W 0603; Manufacturer 1: Yageo; Voltage Rating (DC): 50V; Temperature Coefficient: 100ppm/°C; Power Rating: 100mW; Supplier 1: Arrow Electronics; RoHS: Yes; Category: Chip SMD Resistors; Stock 1: 15000; Pricing 1: 5000=0,00350 (USD); Case/Package: 0603; Number of Pins: 2; Case Code (Metric): 1608; Case Code (Imperial): 0603; Size Code: 0603; Min Operating Temperature: -55°C; Max Operating Temperature: 155°C; Tolerance: 1%; Packaging: Tape and Reel; Resistance: 1.5kR; Resistor Type: Thick Film; Voltage Rating: 50V; Package Quantity: 1; Number of Terminations: 2; Termination: SMD/SMT; Max Power Dissipation: 100mW; Features: Moisture Resistant; Series: RC; Resistance Tolerance: 1%; Construction: Rectangular; Length: 0.063inch; Width: 0.031inch; Height: 0.022inch; Depth: 0.8mm; REACH SVHC: No SVHC; Lead Free: Lead Free; Military Standard: Not; RoHS Compliant: Yes; ComponentLink1URL: https://datasheet.ciiva.com/46440/1868787-46440895.pdf?src-supplier=Element14; ComponentLink1Description: https://datasheet.ciiva.com/46440/1868787-46440895.pdf?src-supplier=Element14; ComponentLink2URL: https://datasheet.ciiva.com/2454/pyu-r-int-thick-7-2454514.pdf?src-supplier=Digi-Key; ComponentLink2Description: https://datasheet.ciiva.com/2454/pyu-r-int-thick-7-2454514.pdf?src-supplier=Digi-Key; ComponentLink3URL: https://datasheet.ciiva.com/2454/pyu-r-int-thick-7-2454515.pdf?src-supplier=Digi-Key; ComponentLink3Description: https://datasheet.ciiva.com/2454/pyu-r-int-thick-7-2454515.pdf?src-supplier=Digi-Key; ComponentLink4URL: https://datasheet.ciiva.com/2454/pyu-r-int-thick-7-2454513.pdf?src-supplier=Digi-Key; ComponentLink4Description: https://datasheet.ciiva.com/2454/pyu-r-int-thick-7-2454513.pdf?src-supplier=Digi-Key; Supplier Part Number 1: RC0603FR-071K5L; Manufacturer Part Number 1: RC0603FR-071K5L
R13 R14 = RC0603FR-0724RL: RES 24 OHM 1% 1/10W 0603; Manufacturer 1: Yageo; Power Rating: 100mW; Voltage Rating (DC): 50V; Temperature Coefficient: 100ppm/°C; Working Voltage: 75V; Supplier 1: Arrow Electronics; RoHS: Yes; Category: Chip SMD Resistors; Stock 1: 90000; Pricing 1: 5000=0,00190, 125000=0,00160 (USD); Case/Package: 0603; Case Code (Imperial): 0603; Case Code (Metric): 1608; Min Operating Temperature: -55°C; Max Operating Temperature: 155°C; Tolerance: 1%; Resistance: 24R; Packaging: Tape and Reel; Voltage Rating: 50V; Termination: SMD/SMT; Number of Terminations: 2; Features: Moisture Resistant; Series: RC; Max Power Dissipation: 100mW; Lead Free: Lead Free; RoHS Compliant: Yes; Supplier Part Number 1: RC0603FR-0724RL; Manufacturer Part Number 1: RC0603FR-0724RL
U4 = USBLC6-2SC6: TVS DIODE 5.25VWM 17VC SOT23-6; Manufacturer 1: STMicroelectronics; Direction: Unidirectional,Bidirectional; Capacitance: 3.5pF; Operating Supply Voltage: 1.1V; Number of Channels: 2; Breakdown Voltage: 6V; Clamping Voltage: 17V; Reverse Standoff Voltage: 5.25V; Power Line Protection: Yes; Test Current: 1mA; Max Reverse Leakage Current: 150nA; Peak Pulse Current: 5A; Element Configuration: Dual; Data Rate: 480Mbps; Number of Elements: 1; Working Voltage: 5V; Supplier 1: Digi-Key; RoHS: Yes; Category: TVS Diodes; Pricing 1: 1=0.63000, 10=0.54200, 100=0.40440, 500=0.31774, 1000=0.24553 (USD); Mount: Surface Mount; Case/Package: SOT-23; Number of Pins: 6; Contact Plating: Tin,Matte; Min Operating Temperature: -40°C; Max Operating Temperature: 125°C; Packaging: Tape and Reel; Package Quantity: 3000; Termination: SMD/SMT; Number of Bidirectional Channels: 2; Min Breakdown Voltage: 6V; ESD Protection: Yes; Leakage Current: 150nA; Series: USB; Reverse Breakdown Voltage: 6V; Polarity: Unidirectional,Bidirectional; Max Breakdown Voltage: 6V; Clamping Voltage-Max: 17V; Length: 3.05mm; Width: 1.75mm; Height: 1.3mm; Depth: 1.75mm; Radiation Hardening: No; REACH SVHC: No SVHC; Lead Free: Lead Free; RoHS Compliant: Yes; ComponentLink1URL: https://datasheet.ciiva.com/1268/1690354-1268384.pdf?src-supplier=Element14; ComponentLink1Description: https://datasheet.ciiva.com/1268/1690354-1268384.pdf?src-supplier=Element14; ComponentLink2URL: https://datasheet.ciiva.com/4508/cd00050750-113117-4508433.pdf?src-supplier=Mouser; ComponentLink2Description: https://datasheet.ciiva.com/4508/cd00050750-113117-4508433.pdf?src-supplier=Mouser; ComponentLink3URL: https://datasheet.ciiva.com/15143/getdatasheetpartid-148465-15143789.pdf?src-supplier=Verical; ComponentLink3Description: https://datasheet.ciiva.com/15143/getdatasheetpartid-148465-15143789.pdf?src-supplier=Verical; ComponentLink4URL: https://datasheet.ciiva.com/16200/cd00050750-16200026.pdf?src-supplier=Future+Electronics; ComponentLink4Description: https://datasheet.ciiva.com/16200/cd00050750-16200026.pdf?src-supplier=Future+Electronics; ComponentLink5URL: https://datasheet.ciiva.com/41444/001184109-da-01-en-ic-esd-protecti-usblc6-2sc6-sot-23-6-stm-41444156.pdf?src-supplier=Conrad; ComponentLink5Description: https://datasheet.ciiva.com/41444/001184109-da-01-en-ic-esd-protecti-usblc6-2sc6-sot-23-6-stm-41444156.pdf?src-supplier=Conrad; Supplier Part Number 1: 497-5235-6-ND; Manufacturer Part Number 1: USBLC6-2SC6

## Sheet Industrial-Controller_ESP8266.SchDoc: ESP8266
size 279 x 215 mm; Date: not used; ApprovedBy: not used; CheckedBy: not used; Author: not used; CompanyName: MRobot, LCC; DrawnBy: not used; Engineer: Podlesnyi Vasilii; Organization: not used; Address1: nab. reki Karpovki, d. 5/3E; Address2: Saint-Petersburg, 197022; Address3: Ph: +7 (911) 701-51-99; Address4: not used; DocumentNumber: 0000-0000; Revision: 0.1.0; SheetNumber: 8; SheetTotal: 21; ProjectTitle: Industrial Controller; Time: not used; ImagePath: not used; Application_BuildNumber: not used
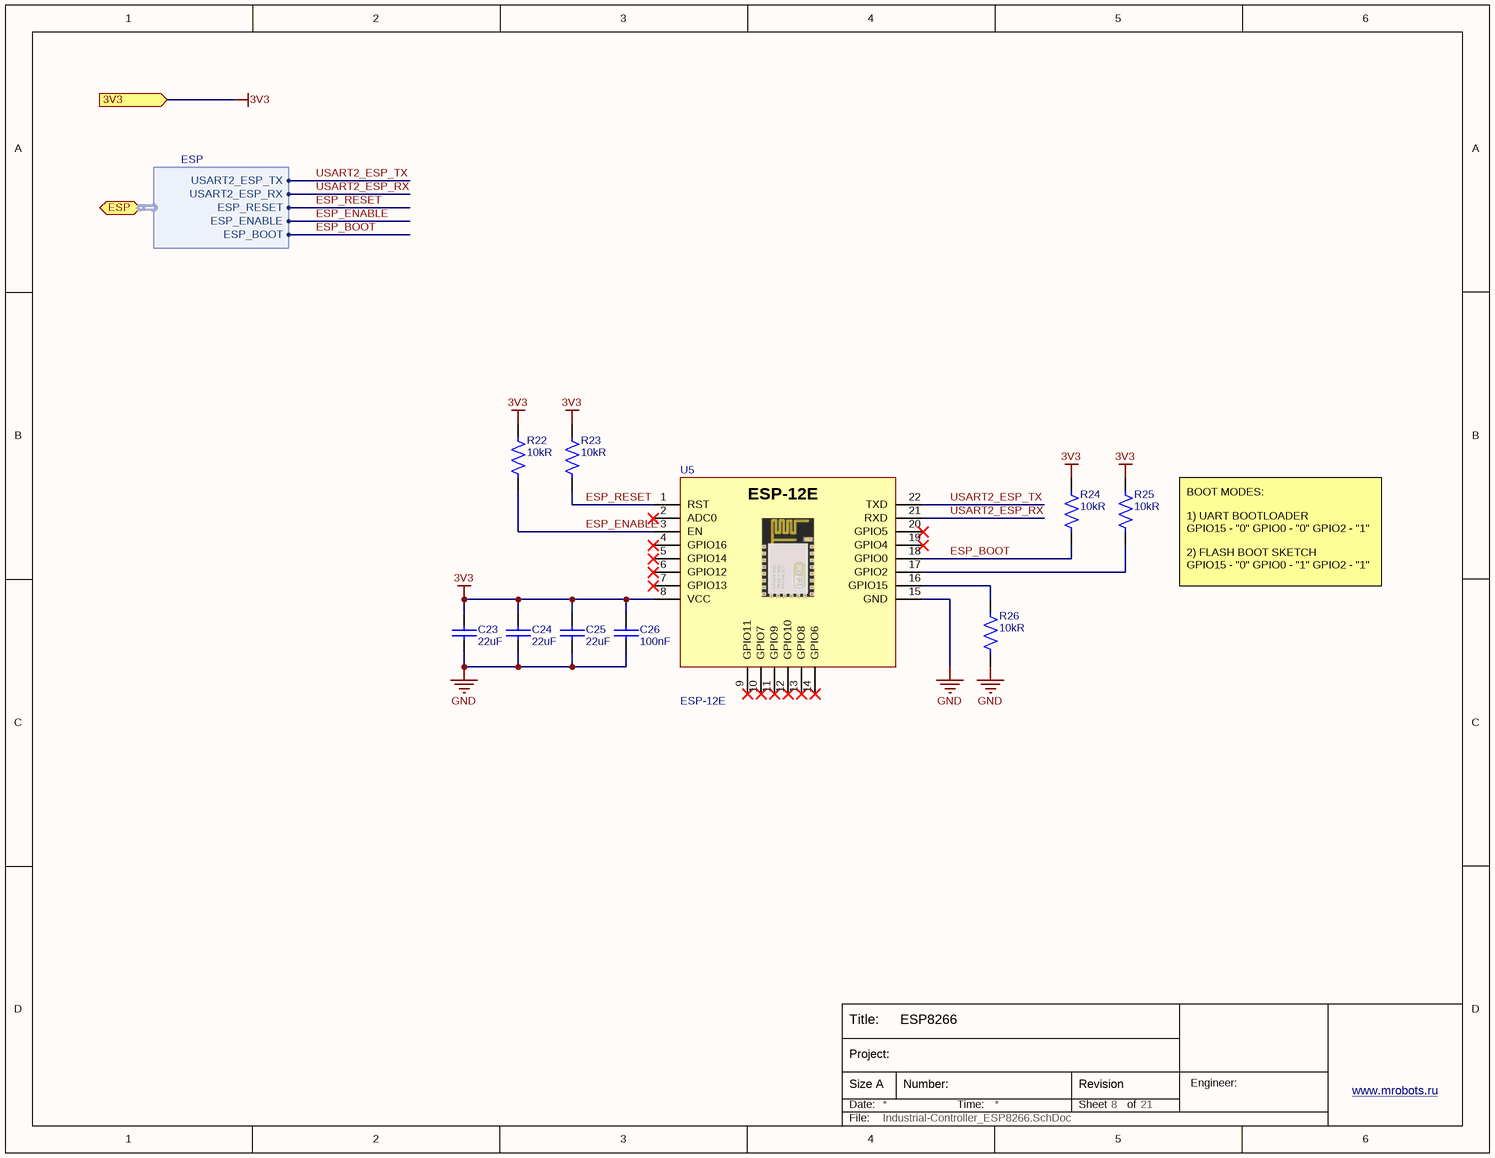
[diagram p4: Industrial-Controller_ESP8266.SchDoc]

### Parts
C23  22uF  [CAP_1210]
C24  22uF  [CAP_1210]
C25  22uF  [CAP_1210]
C26  100nF  [CAP_0603]
R22  10kR  [RES_0603]
R23  10kR  [RES_0603]
R24  10kR  [RES_0603]
R25  10kR  [RES_0603]
R26  10kR  [RES_0603]
U5  ESP-12E  [ESP-12E]

### Ports
3V3 (in), ESP (bidir, harness ESP)

### Harnesses
ESP: USART2_ESP_TX, USART2_ESP_RX, ESP_RESET, ESP_ENABLE, ESP_BOOT

### Nets
3V3: C23.2 C24.2 C25.2 C26.1 R22.1 R23.1 R24.1 R25.1 U5.8(VCC) ; port 3V3
GND: C23.1 C24.1 C25.1 C26.2 R26.2 U5.15(GND)
ESP_BOOT: R24.2 U5.18(GPIO0) ; port ESP.ESP_BOOT
ESP_ENABLE: R22.2 U5.3(EN) ; port ESP.ESP_ENABLE
ESP_RESET: R23.2 U5.1(RST) ; port ESP.ESP_RESET
USART2_ESP_RX: U5.21(RXD) ; port ESP.USART2_ESP_RX
USART2_ESP_TX: U5.22(TXD) ; port ESP.USART2_ESP_TX
NetR25_2: R25.2 U5.17(GPIO2)
NetR26_1: R26.1 U5.16(GPIO15)

Not connected (* = marked no-connect by the designer): U5 2(ADC0)* 4(GPIO16)* 5(GPIO14)* 6(GPIO12)* 7(GPIO13)* 9(GPIO11)* 10(GPIO7)* 11(GPIO9)* 12(GPIO10)* 13(GPIO8)* 14(GPIO6)* 19(GPIO4)* 20(GPIO5)*

### Notes on the sheet
- BOOT MODES:
  1) UART BOOTLOADER
  GPIO15 - "0" GPIO0 - "0" GPIO2 - "1"
  2) FLASH BOOT SKETCH
  GPIO15 - "0" GPIO0 - "1" GPIO2 - "1"
- Title:
- Date:
- Size A
- Project:
- Number:
- Time:
- Sheet
- Revision
- of
- Engineer:
- www.mrobots.ru <http://mrobots.ru/>
- File:

### Library data of the parts
C23-C25 = CL32B226KAJNNNE: CAP CER 22UF 25V X7R 1210; Manufacturer 1: Samsung; Material: Ceramic; Tolerance: 10%; Supplier 1: Digi-Key; Manufacturer Part Number 1: CL32B226KAJNNNE; RoHS: Yes; Category: Ceramic Capacitors; Stock 1: 784003; Pricing 1: 1=0,58000, 10=0,41000, 50=0,31000, 100=0,26990, 500=0,19996 (USD); Mount: Surface Mount; Case/Package: 1210; Case Code (Metric): 3225; Case Code (Imperial): 1210; Min Operating Temperature: -55°C; Max Operating Temperature: 125°C; Package Quantity: 1; Packaging: Tape and Reel; Capacitance: 22uF; Voltage Rating: 25V; Dielectric: X7R; Series: CL; Construction: Flat; Voltage Rating (DC): 25V; Length: 3.2mm; Width: 0.098inch; Height: 2.5mm; Thickness: 0.106inch; Depth: 2.5mm; Radiation Hardening: No; RoHS Compliant: Yes; Lead Free: Lead Free; ComponentLink1URL: https://datasheet.ciiva.com/25714/cl32b226kajnnne-25714610.pdf?src-supplier=Digi-Key; ComponentLink1Description: https://datasheet.ciiva.com/25714/cl32b226kajnnne-25714610.pdf?src-supplier=Digi-Key; Supplier Part Number 1: 1276-3392-1-ND
C26 = CL10B104KB8NNNL: as C14 on sheet Industrial-Controller_MCU; Supplier 1: Digi-Key; Manufacturer Part Number 1: CL10B104KB8NNNL; RoHS: Yes; Category: Ceramic Capacitors; Stock 1: 2348404; Pricing 1: 15000=0,00532, 30000=0,00506 (USD); Mount: Surface Mount; Case/Package: 0603; Min Operating Temperature: -55°C; Max Operating Temperature: 125°C; Capacitance: 100nF; Packaging: Tape and Reel; Package Quantity: 15000; Voltage Rating: 50V; Dielectric: X7R; Voltage Rating (DC): 50V; Series: CL; Construction: Flat; Length: 1.6mm; Width: 0.031inch; Height: 0.8mm; Thickness: 0.035inch; Depth: 0.8mm; Radiation Hardening: No; RoHS Compliant: Yes; ComponentLink1URL: https://datasheet.ciiva.com/26838/getdatasheetpartid-357523-26838415.pdf?src-supplier=Verical; ComponentLink1Description: https://datasheet.ciiva.com/26838/getdatasheetpartid-357523-26838415.pdf?src-supplier=Verical; ComponentLink2URL: https://datasheet.ciiva.com/25741/cl10b104kb8nnnl-25741341.pdf?src-supplier=Digi-Key; ComponentLink2Description: https://datasheet.ciiva.com/25741/cl10b104kb8nnnl-25741341.pdf?src-supplier=Digi-Key; Supplier Part Number 1: 1276-CL10B104KB8NNNLTR-ND
R22-R26 = RC0603FR-0710KL: as R9 on sheet Industrial-Controller_MCU; Supplier 1: Arrow Electronics; RoHS: Yes; Category: Chip SMD Resistors; Stock 1: 4950000; Pricing 1: 5000=0,00240 (USD); Case/Package: 0603; Number of Pins: 2; Case Code (Imperial): 0603; Case Code (Metric): 1608; Weight: 7.1E-05oz; Size Code: 0603; Min Operating Temperature: -55°C; Max Operating Temperature: 155°C; Packaging: Tape and Reel; Resistance: 10kR; Tolerance: 1%; Resistor Type: Thick Film; Termination: SMD/SMT; Features: Moisture Resistant; Series: RC; Max Power Dissipation: 100mW; Number of Terminations: 2; Resistance Tolerance: 1%; Construction: Rectangular; Length: 1.6mm; Width: 0.8mm; Height: 0.45mm; Depth: 0.8mm; Lead Pitch: 0.3mm; REACH SVHC: Unknown; Lead Free: Lead Free; Military Standard: Not; RoHS Compliant: Yes; ComponentLink1URL: https://datasheet.ciiva.com/7660/38590-7660789.pdf?src-supplier=Element14; ComponentLink1Description: https://datasheet.ciiva.com/7660/38590-7660789.pdf?src-supplier=Element14; ComponentLink2URL: https://datasheet.ciiva.com/7983/443971-7983596.pdf?src-supplier=Element14; ComponentLink2Description: https://datasheet.ciiva.com/7983/443971-7983596.pdf?src-supplier=Element14; ComponentLink3URL: https://datasheet.ciiva.com/22747/443971-22747519.pdf?src-supplier=Element14; ComponentLink3Description: https://datasheet.ciiva.com/22747/443971-22747519.pdf?src-supplier=Element14; ComponentLink4URL: https://datasheet.ciiva.com/46440/1868787-46440891.pdf?src-supplier=Element14; ComponentLink4Description: https://datasheet.ciiva.com/46440/1868787-46440891.pdf?src-supplier=Element14; ComponentLink5URL: https://datasheet.ciiva.com/7746/1738695-7746239.pdf?src-supplier=Element14; ComponentLink5Description: https://datasheet.ciiva.com/7746/1738695-7746239.pdf?src-supplier=Element14; Supplier Part Number 1: RC0603FR-0710KL; Manufacturer Part Number 1: RC0603FR-0710KL
U5 = ESP-12E: MOD 802.11 BLUETOOTH 5 CHIP ANT; Manufacturer 1: Ai-Thinker; Manufacturer Part Number 1: ESP-12E